# Altium project dory-x.PrjPcb (part 2 of 12)
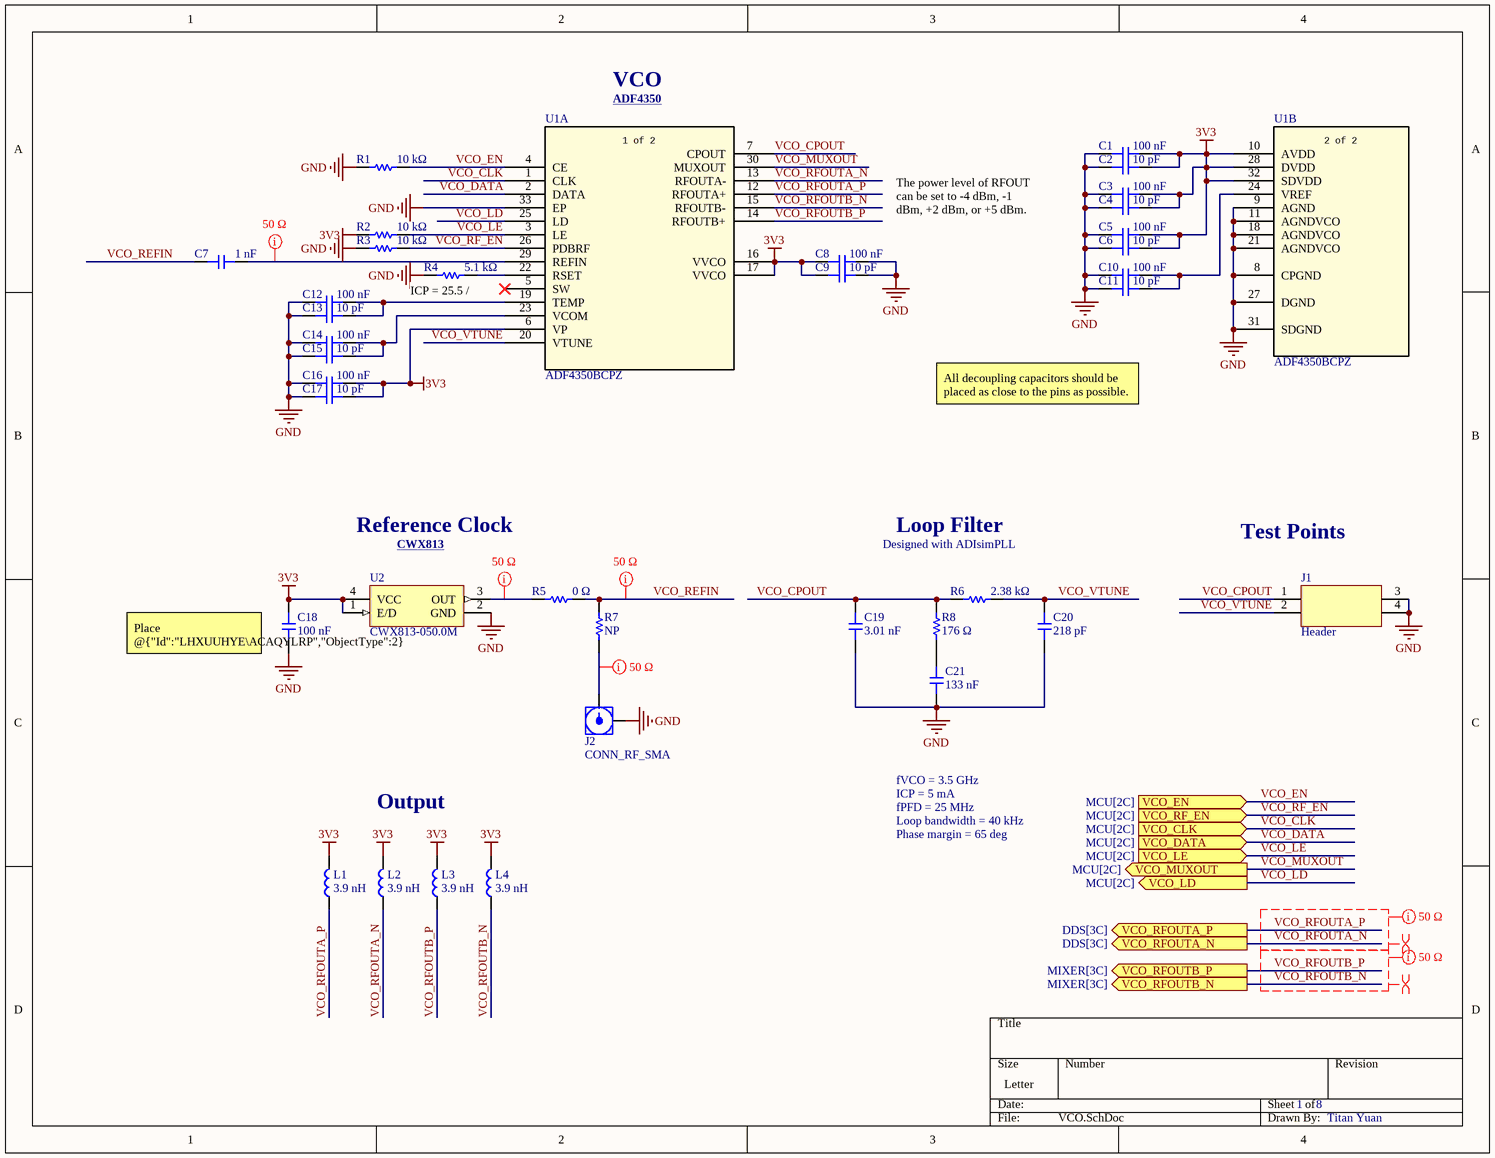
[diagram p8: VCO.SchDoc]

## Sheet VCO.SchDoc (continued)
### Library data of the parts
C1 C3 C5 C8 C10 C12 C14 C16 C18 = CAP: Ceramic Capacitor, Ceramic, 50V, 10% +Tol, 10% -Tol, X7R, 15% TC, 0.1uF, Surface Mount, 0402; Manufacturer: Yageo; Manufacturer Part Number: CC0402KPX7R9BB104; Tolerance: +-10%; Value: 100nF; Voltage Rating: 50 V; Dielectric: Ceramic; Package Size: 0402; Supplier: DigiKey; Supplier Part Number: 13-CC0402KPX7R9BB104CT-ND; RoHS: Compliant; Category: Ceramic Capacitors; Stock: 40680; Pricing: 1=0.1, 10=0.053, 50=0.0364, 100=0.0313, 500=0.02292, 1000=0.02035, 2500=0.01764, 5000=0.01601 (USD); Case/Package: 0402; China RoHS: Compliant; Dielectric Material: Ceramic; Height: 500µm; Lead Free: Lead Free; Length: 1mm; Lifecycle Status: Production; Max Operating Temperature: 125°C; Min Operating Temperature: -55°C; Mounting Technology: Surface Mount; Number of Terminals: 2; REACH SVHC: Yes; Voltage Rating (DC): 50V; Width: 500µm; ComponentLink1URL: https://datasheet.octopart.com:443/CC0402KPX7R9BB104-Yageo-datasheet-177165144.pdf?src-supplier=IHS; ComponentLink1Description: https://datasheet.octopart.com:443/CC0402KPX7R9BB104-Yageo-datasheet-177165144.pdf?src-supplier=IHS; ComponentLink2URL: https://datasheet.octopart.com:443/CC0402KPX7R9BB104-Yageo-Group-datasheet-189192896.pdf?src-supplier=Future+Electronics; ComponentLink2Description: https://datasheet.octopart.com:443/CC0402KPX7R9BB104-Yageo-Group-datasheet-189192896.pdf?src-supplier=Future+Electronics; ComponentLink3URL: https://datasheet.octopart.com:443/CC0402KPX7R9BB104-Yageo-datasheet-181967134.pdf?src-supplier=Farnell; ComponentLink3Description: https://datasheet.octopart.com:443/CC0402KPX7R9BB104-Yageo-datasheet-181967134.pdf?src-supplier=Farnell; ComponentLink4URL: https://datasheet.octopart.com/Surface-Mount-Ceramic-Multilayer-Capacitors%3B-General-Purpose-%26-High-Capacitance-Class-2%2C-X7R-Yageo-datasheet-family-114.pdf; ComponentLink4Description: https://datasheet.octopart.com/Surface-Mount-Ceramic-Multilayer-Capacitors%3B-General-Purpose-%26-High-Capacitance-Class-2%2C-X7R-Yageo-datasheet-family-114.pdf; ComponentLink5URL: https://datasheet.octopart.com/CC0402KPX7R9BB104-Yageo-datasheet-10883670.pdf; ComponentLink5Description: https://datasheet.octopart.com/CC0402KPX7R9BB104-Yageo-datasheet-10883670.pdf; ComponentLink6URL: http://sigma.octopart.com:80/rohs_statement/Surface-Mount-Ceramic-Multilayer-Capacitors%3B-General-Purpose-%26-High-Capacitance-Class-2%2C-X7R-Yageo-family-124.pdf?src-supplier=Compliance+Statements; ComponentLink6Description: http://sigma.octopart.com:80/rohs_statement/Surface-Mount-Ceramic-Multilayer-Capacitors%3B-General-Purpose-%26-High-Capacitance-Class-2%2C-X7R-Yageo-family-124.pdf?src-supplier=Compliance+Statements; ComponentLink7URL: http://sigma.octopart.com:80/reach_statement/Surface-Mount-Ceramic-Multilayer-Capacitors%3B-General-Purpose-%26-High-Capacitance-Class-2%2C-X7R-Yageo-family-125.pdf?src-supplier=Compliance+Statements; ComponentLink7Description: http://sigma.octopart.com:80/reach_statement/Surface-Mount-Ceramic-Multilayer-Capacitors%3B-General-Purpose-%26-High-Capacitance-Class-2%2C-X7R-Yageo-family-125.pdf?src-supplier=Compliance+Statements; ComponentLink8URL: http://sigma.octopart.com:80/conflict_mineral_statement/Yageo-company-3.pdf?src-supplier=Compliance+Statements; ComponentLink8Description: http://sigma.octopart.com:80/conflict_mineral_statement/Yageo-company-3.pdf?src-supplier=Compliance+Statements; ComponentLink9URL: http://sigma.octopart.com:80/rohs_statement/Yageo-company-2.pdf?src-supplier=Compliance+Statements; ComponentLink9Description: http://sigma.octopart.com:80/rohs_statement/Yageo-company-2.pdf?src-supplier=Compliance+Statements
C2 C4 C6 C9 C11 C13 C15 C17 = CAP: 50V 10pF C0G ±1% 0402 Multilayer Ceramic Capacitors MLCC - SMD/SMT ROHS; Manufacturer: Murata Electronics; Manufacturer Part Number: GRM1555C1H100FA01D; Manufacturer Lifecycle Status: NRND; Tolerance: +-1%; Voltage Rating: 50 V; Dielectric: Ceramic; Package Size: 0402; Supplier: DigiKey; Supplier Part Number: 490-6186-1-ND; RoHS: Compliant; Category: Ceramic Capacitors; Stock: 3575844; Pricing: 1=0.1, 10=0.042, 50=0.0286, 100=0.0246, 500=0.0178, 1000=0.01571, 2500=0.01351, 5000=0.01219 (USD); Value: 10pF; Case/Package: 0402; Case Code (Imperial): 0402; Case Code (Metric): 1005; Depth: 500µm; Dielectric Material: Ceramic; Export Control Classification Number (ECCN) Code: EAR99; Height: 500µm; Harmonized Tariff Schedule (HTS) Code: 8532.24.00.20; Introduction Date: 2012-06-13; Lead Free: Lead Free; Length: 1mm; Lifecycle Status: NRND; Max Operating Temperature: 125°C; Min Operating Temperature: -55°C; Mounting Technology: Surface Mount; Number of Terminals: 2; Packaging: Cut Tape; Radiation Hardening: No; REACH SVHC: Yes; Schedule B: 8532240020, 8532240020|8532240020, 8532240020|8532240020|8532240020, 8532240020|8532240020|8532240020|8532240020; Termination: SMD/SMT; Thickness: 500µm; Voltage Rating (DC): 50V; Width: 500µm; ComponentLink1URL: https://datasheet.octopart.com:443/GRM1555C1H100FA01D-Murata-datasheet-66077043.pdf?src-supplier=element14+APAC; ComponentLink1Description: https://datasheet.octopart.com:443/GRM1555C1H100FA01D-Murata-datasheet-66077043.pdf?src-supplier=element14+APAC; ComponentLink2URL: https://datasheet.octopart.com:443/GRM1555C1H100FA01D-Murata-datasheet-141266224.pdf?src-supplier=Ciiva; ComponentLink2Description: https://datasheet.octopart.com:443/GRM1555C1H100FA01D-Murata-datasheet-141266224.pdf?src-supplier=Ciiva; ComponentLink3URL: https://datasheet.octopart.com:443/GRM1555C1H100FA01D-Murata-datasheet-140680630.pdf?src-supplier=Ciiva; ComponentLink3Description: https://datasheet.octopart.com:443/GRM1555C1H100FA01D-Murata-datasheet-140680630.pdf?src-supplier=Ciiva; ComponentLink4URL: https://datasheet.octopart.com:443/GRM1555C1H100FA01D-Murata-datasheet-138739437.pdf?src-supplier=Ciiva; ComponentLink4Description: https://datasheet.octopart.com:443/GRM1555C1H100FA01D-Murata-datasheet-138739437.pdf?src-supplier=Ciiva; ComponentLink5URL: https://datasheet.octopart.com:443/GRM1555C1H100FA01D-Murata-datasheet-120101189.pdf?src-supplier=Megastar; ComponentLink5Description: https://datasheet.octopart.com:443/GRM1555C1H100FA01D-Murata-datasheet-120101189.pdf?src-supplier=Megastar; ComponentLink6URL: https://datasheet.octopart.com:443/GRM1555C1H100FA01D-Murata-datasheet-22122223.pdf?src-supplier=Future+Electronics; ComponentLink6Description: https://datasheet.octopart.com:443/GRM1555C1H100FA01D-Murata-datasheet-22122223.pdf?src-supplier=Future+Electronics; ComponentLink7URL: https://datasheet.octopart.com:443/GRM1555C1H100FA01D-Murata-datasheet-12510170.pdf?src-supplier=Future+Electronics; ComponentLink7Description: https://datasheet.octopart.com:443/GRM1555C1H100FA01D-Murata-datasheet-12510170.pdf?src-supplier=Future+Electronics; ComponentLink8URL: https://datasheet.octopart.com:443/GRM1555C1H100FA01D-Murata-datasheet-8517407.pdf?src-supplier=Future+Electronics; ComponentLink8Description: https://datasheet.octopart.com:443/GRM1555C1H100FA01D-Murata-datasheet-8517407.pdf?src-supplier=Future+Electronics; ComponentLink9URL: https://datasheet.octopart.com:443/GRM1555C1H100FA01D-Murata-datasheet-8387045.pdf?src-supplier=Future+Electronics; ComponentLink9Description: https://datasheet.octopart.com:443/GRM1555C1H100FA01D-Murata-datasheet-8387045.pdf?src-supplier=Future+Electronics; ComponentLink10URL: https://datasheet.octopart.com:443/GRM1555C1H100FA01D-Murata-datasheet-8324201.pdf?src-supplier=Future+Electronics; ComponentLink10Description: https://datasheet.octopart.com:443/GRM1555C1H100FA01D-Murata-datasheet-8324201.pdf?src-supplier=Future+Electronics; ComponentLink11URL: https://datasheet.octopart.com:443/GRM1555C1H100FA01D-Murata-datasheet-7628724.pdf?src-supplier=Future+Electronics; ComponentLink11Description: https://datasheet.octopart.com:443/GRM1555C1H100FA01D-Murata-datasheet-7628724.pdf?src-supplier=Future+Electronics; ComponentLink12URL: https://datasheet.octopart.com:443/GRM1555C1H100FA01D-Murata-datasheet-552801.pdf?src-supplier=Future+Electronics; ComponentLink12Description: https://datasheet.octopart.com:443/GRM1555C1H100FA01D-Murata-datasheet-552801.pdf?src-supplier=Future+Electronics; ComponentLink13URL: https://datasheet.octopart.com/GRM1555C1H100FA01D-Murata-datasheet-12515295.pdf; ComponentLink13Description: https://datasheet.octopart.com/GRM1555C1H100FA01D-Murata-datasheet-12515295.pdf; ComponentLink14URL: https://datasheet.octopart.com/GRM1555C1H100FA01D-Murata-datasheet-12510076.pdf; ComponentLink14Description: https://datasheet.octopart.com/GRM1555C1H100FA01D-Murata-datasheet-12510076.pdf; ComponentLink15URL: https://datasheet.octopart.com/GRM1555C1H100FA01D-Murata-datasheet-11978611.pdf; ComponentLink15Description: https://datasheet.octopart.com/GRM1555C1H100FA01D-Murata-datasheet-11978611.pdf; ComponentLink16URL: https://datasheet.octopart.com/GRM1555C1H100FA01D-Murata-datasheet-10025737.pdf; ComponentLink16Description: https://datasheet.octopart.com/GRM1555C1H100FA01D-Murata-datasheet-10025737.pdf; ComponentLink17URL: https://datasheet.octopart.com/GRM1555C1H100FA01D-Murata-datasheet-8819587.pdf; ComponentLink17Description: https://datasheet.octopart.com/GRM1555C1H100FA01D-Murata-datasheet-8819587.pdf; ComponentLink18URL: https://datasheet.octopart.com:443/GRM1555C1H100FA01D-Murata-datasheet-11729174.pdf?src-supplier=Arrow+Electronics; ComponentLink18Description: https://datasheet.octopart.com:443/GRM1555C1H100FA01D-Murata-datasheet-11729174.pdf?src-supplier=Arrow+Electronics; ComponentLink19URL: http://sigma.octopart.com:80/reach_statement/Murata-company-16.pdf?src-supplier=Compliance+Statements; ComponentLink19Description: http://sigma.octopart.com:80/reach_statement/Murata-company-16.pdf?src-supplier=Compliance+Statements
C7 = CAP: 50V 1nF X7R ±10% 0402 Multilayer Ceramic Capacitors MLCC - SMD/SMT ROHS; Manufacturer: Yageo; Manufacturer Part Number: CC0402KRX7R9BB102; Tolerance: +-10%; Insulation Resistance: 100GΩ; Temperature Coefficient: 30ppm/°C; Voltage Rating: 50 V; Dielectric: Ceramic; Package Size: 0402; Supplier: DigiKey; Supplier Part Number: 311-1036-1-ND; RoHS: Compliant; Category: Ceramic Capacitors; Stock: 3090255; Pricing: 1=0.08, 10=0.004 (USD); Value: 1nF; Case/Package: 0402; Case Code (Imperial): 0402; Case Code (Metric): 1005; China RoHS: Compliant; Composition: Ceramic; Country of Origin: Mainland China, Taiwan; Depth: 500µm; Dielectric Material: Ceramic; Export Control Classification Number (ECCN) Code: EAR99; Halogen Free: Halogen Free; Height: 500µm; Harmonized Tariff Schedule (HTS) Code: 8532.24.00.20; Introduction Date: 2003-01-27; Lead Free: Lead Free; Length: 1mm; Lifecycle Status: Production; Material: Ceramic; Max Operating Temperature: 125°C; Min Operating Temperature: -55°C; Mounting Technology: Surface Mount; Pins: 2; Number of Terminals: 2; Radiation Hardening: No; REACH SVHC: Yes; Schedule B: 8532240020, 8532240020|8532240020|8532240020|8532240020|8532240020|8532240020|8532240020|8532240020|8532240020|8532240020|8532240020|8532240020|8532240020|8532240020|8532240020|8532240020|8532240020|8532240020|8532240020|8532240020|8532240020|8532240020|8532240020|85; Termination: SMD/SMT; Thickness: 558.8µm; Voltage: 50V; Voltage Rating (AC): 50V; Voltage Rating (DC): 50V; Width: 500µm; ComponentLink1URL: https://datasheet.octopart.com:443/CC0402KRX7R9BB102-Yageo-datasheet-177165144.pdf?src-supplier=IHS; ComponentLink1Description: https://datasheet.octopart.com:443/CC0402KRX7R9BB102-Yageo-datasheet-177165144.pdf?src-supplier=IHS; ComponentLink2URL: https://datasheet.octopart.com:443/CC0402KRX7R9BB102-Yageo-datasheet-82288757.pdf?src-supplier=Upverter; ComponentLink2Description: https://datasheet.octopart.com:443/CC0402KRX7R9BB102-Yageo-datasheet-82288757.pdf?src-supplier=Upverter; ComponentLink3URL: https://datasheet.octopart.com:443/CC0402KRX7R9BB102-Yageo-datasheet-78855684.pdf?src-supplier=Upverter; ComponentLink3Description: https://datasheet.octopart.com:443/CC0402KRX7R9BB102-Yageo-datasheet-78855684.pdf?src-supplier=Upverter; ComponentLink4URL: https://datasheet.octopart.com/CC0402KRX7R9BB102-Yageo-datasheet-10883670.pdf; ComponentLink4Description: https://datasheet.octopart.com/CC0402KRX7R9BB102-Yageo-datasheet-10883670.pdf; ComponentLink5URL: https://datasheet.octopart.com:443/CC0402KRX7R9BB102-Yageo-datasheet-147453679.pdf?src-supplier=Farnell; ComponentLink5Description: https://datasheet.octopart.com:443/CC0402KRX7R9BB102-Yageo-datasheet-147453679.pdf?src-supplier=Farnell; ComponentLink6URL: https://datasheet.octopart.com:443/CC0402KRX7R9BB102-Yageo-datasheet-151948686.pdf?src-supplier=Farnell; ComponentLink6Description: https://datasheet.octopart.com:443/CC0402KRX7R9BB102-Yageo-datasheet-151948686.pdf?src-supplier=Farnell; ComponentLink7URL: https://datasheet.octopart.com:443/CC0402KRX7R9BB102-Phycomp-datasheet-500777.pdf?src-supplier=Farnell; ComponentLink7Description: https://datasheet.octopart.com:443/CC0402KRX7R9BB102-Phycomp-datasheet-500777.pdf?src-supplier=Farnell; ComponentLink8URL: https://datasheet.octopart.com:443/CC0402KRX7R9BB102-Yageo-datasheet-5301394.pdf?src-supplier=Newark; ComponentLink8Description: https://datasheet.octopart.com:443/CC0402KRX7R9BB102-Yageo-datasheet-5301394.pdf?src-supplier=Newark; ComponentLink9URL: https://datasheet.octopart.com:443/CC0402KRX7R9BB102-Yageo-datasheet-62336348.pdf?src-supplier=Newark; ComponentLink9Description: https://datasheet.octopart.com:443/CC0402KRX7R9BB102-Yageo-datasheet-62336348.pdf?src-supplier=Newark; ComponentLink10URL: https://datasheet.octopart.com:443/CC0402KRX7R9BB102-Yageo-datasheet-182878162.pdf?src-supplier=Newark; ComponentLink10Description: https://datasheet.octopart.com:443/CC0402KRX7R9BB102-Yageo-datasheet-182878162.pdf?src-supplier=Newark; ComponentLink11URL: https://datasheet.octopart.com:443/CC0402KRX7R9BB102-Phycomp-datasheet-499490.pdf?src-supplier=element14; ComponentLink11Description: https://datasheet.octopart.com:443/CC0402KRX7R9BB102-Phycomp-datasheet-499490.pdf?src-supplier=element14; ComponentLink12URL: https://datasheet.octopart.com:443/CC0402KRX7R9BB102-Yageo-datasheet-8701427.pdf?src-supplier=element14; ComponentLink12Description: https://datasheet.octopart.com:443/CC0402KRX7R9BB102-Yageo-datasheet-8701427.pdf?src-supplier=element14; ComponentLink13URL: https://datasheet.octopart.com:443/CC0402KRX7R9BB102-Yageo-datasheet-166511530.pdf?src-supplier=Future+Electronics; ComponentLink13Description: https://datasheet.octopart.com:443/CC0402KRX7R9BB102-Yageo-datasheet-166511530.pdf?src-supplier=Future+Electronics; ComponentLink14URL: https://datasheet.octopart.com:443/CC0402KRX7R9BB102-Yageo-datasheet-137700082.pdf?src-supplier=Future+Electronics; ComponentLink14Description: https://datasheet.octopart.com:443/CC0402KRX7R9BB102-Yageo-datasheet-137700082.pdf?src-supplier=Future+Electronics; ComponentLink15URL: https://datasheet.octopart.com:443/CC0402KRX7R9BB102-Yageo-datasheet-137700084.pdf?src-supplier=Future+Electronics; ComponentLink15Description: https://datasheet.octopart.com:443/CC0402KRX7R9BB102-Yageo-datasheet-137700084.pdf?src-supplier=Future+Electronics; ComponentLink16URL: https://datasheet.octopart.com:443/CC0402KRX7R9BB102-Yageo-datasheet-78855685.pdf?src-supplier=Future+Electronics; ComponentLink16Description: https://datasheet.octopart.com:443/CC0402KRX7R9BB102-Yageo-datasheet-78855685.pdf?src-supplier=Future+Electronics; ComponentLink17URL: https://datasheet.octopart.com:443/CC0402KRX7R9BB102-Yageo-datasheet-27626582.pdf?src-supplier=Future+Electronics; ComponentLink17Description: https://datasheet.octopart.com:443/CC0402KRX7R9BB102-Yageo-datasheet-27626582.pdf?src-supplier=Future+Electronics; ComponentLink18URL: https://datasheet.octopart.com:443/CC0402KRX7R9BB102-Yageo-datasheet-24578986.pdf?src-supplier=Future+Electronics; ComponentLink18Description: https://datasheet.octopart.com:443/CC0402KRX7R9BB102-Yageo-datasheet-24578986.pdf?src-supplier=Future+Electronics; ComponentLink19URL: https://datasheet.octopart.com:443/CC0402KRX7R9BB102-Yageo-datasheet-15895757.pdf?src-supplier=Future+Electronics; ComponentLink19Description: https://datasheet.octopart.com:443/CC0402KRX7R9BB102-Yageo-datasheet-15895757.pdf?src-supplier=Future+Electronics; ComponentLink20URL: https://datasheet.octopart.com:443/CC0402KRX7R9BB102-Yageo-datasheet-12526321.pdf?src-supplier=Future+Electronics; ComponentLink20Description: https://datasheet.octopart.com:443/CC0402KRX7R9BB102-Yageo-datasheet-12526321.pdf?src-supplier=Future+Electronics; ComponentLink21URL: https://datasheet.octopart.com:443/CC0402KRX7R9BB102-Yageo-datasheet-8324192.pdf?src-supplier=Future+Electronics; ComponentLink21Description: https://datasheet.octopart.com:443/CC0402KRX7R9BB102-Yageo-datasheet-8324192.pdf?src-supplier=Future+Electronics; ComponentLink22URL: https://datasheet.octopart.com:443/CC0402KRX7R9BB102-Yageo-datasheet-68298032.pdf?src-supplier=Future+Electronics; ComponentLink22Description: https://datasheet.octopart.com:443/CC0402KRX7R9BB102-Yageo-datasheet-68298032.pdf?src-supplier=Future+Electronics; ComponentLink23URL: https://datasheet.octopart.com:443/CC0402KRX7R9BB102-Yageo-datasheet-178018854.pdf?src-supplier=Burklin+Elektronik; ComponentLink23Description: https://datasheet.octopart.com:443/CC0402KRX7R9BB102-Yageo-datasheet-178018854.pdf?src-supplier=Burklin+Elektronik; ComponentLink24URL: https://datasheet.octopart.com:443/CC0402KRX7R9BB102-Yageo-Group-datasheet-165992755.pdf?src-supplier=ODG+(Origin+Data+Global); ComponentLink24Description: https://datasheet.octopart.com:443/CC0402KRX7R9BB102-Yageo-Group-datasheet-165992755.pdf?src-supplier=ODG+(Origin+Data+Global); ComponentLink25URL: https://datasheet.octopart.com:443/CC0402KRX7R9BB102-Yageo-datasheet-120101875.pdf?src-supplier=Megastar; ComponentLink25Description: https://datasheet.octopart.com:443/CC0402KRX7R9BB102-Yageo-datasheet-120101875.pdf?src-supplier=Megastar; ComponentLink26URL: https://datasheet.octopart.com:443/CC0402KRX7R9BB102-Yageo-datasheet-118396.pdf?src-supplier=DigiKey; ComponentLink26Description: https://datasheet.octopart.com:443/CC0402KRX7R9BB102-Yageo-datasheet-118396.pdf?src-supplier=DigiKey; ComponentLink27URL: http://sigma.octopart.com:80/conflict_mineral_statement/Yageo-company-3.pdf?src-supplier=Compliance+Statements; ComponentLink27Description: http://sigma.octopart.com:80/conflict_mineral_statement/Yageo-company-3.pdf?src-supplier=Compliance+Statements; ComponentLink28URL: http://sigma.octopart.com:80/rohs_statement/Yageo-company-2.pdf?src-supplier=Compliance+Statements; ComponentLink28Description: http://sigma.octopart.com:80/rohs_statement/Yageo-company-2.pdf?src-supplier=Compliance+Statements
C19 = CAP: Ceramic Capacitor, YES, Ceramic, 50V, 1% +Tol, 1% -Tol, C0G, 30ppm/Cel TC, 0.003uF, Surface Mount, 1608M/0603; Manufacturer: Murata Electronics; Manufacturer Part Number: GCM1885C1H302FA16J; Manufacturer Lifecycle Status: IN PRODUCTION; Tolerance: +-1%; Value: 3nF; Temperature Coefficient: 30ppm/°C; Voltage Rating: 50 V; Dielectric: Ceramic; Package Size: 0603; Supplier: DigiKey; Supplier Part Number: 490-GCM1885C1H302FA16JCT-ND; RoHS: Compliant; Category: Ceramic Capacitors; Stock: 41494; Pricing: 1=0.18, 10=0.102, 50=0.072, 100=0.063, 500=0.04632, 1000=0.04311, 2500=0.03819, 5000=0.03522 (USD); Case/Package: 0603; Dielectric Material: Ceramic; Height: 800µm; Length: 1.6mm; Lifecycle Status: Production; Material: Ceramic; Max Operating Temperature: 125°C; Min Operating Temperature: -55°C; Mounting Technology: Surface Mount; Number of Terminals: 2; REACH SVHC: Yes; Thickness: 800µm; Voltage Rating (DC): 50V; Width: 800µm; ComponentLink1URL: https://datasheet.octopart.com:443/GCM1885C1H302FA16J-Murata-datasheet-141266224.pdf?src-supplier=Ciiva; ComponentLink1Description: https://datasheet.octopart.com:443/GCM1885C1H302FA16J-Murata-datasheet-141266224.pdf?src-supplier=Ciiva; ComponentLink2URL: https://datasheet.octopart.com:443/GCM1885C1H302FA16J-Murata-datasheet-140656993.pdf?src-supplier=Ciiva; ComponentLink2Description: https://datasheet.octopart.com:443/GCM1885C1H302FA16J-Murata-datasheet-140656993.pdf?src-supplier=Ciiva; ComponentLink3URL: https://datasheet.octopart.com:443/GCM1885C1H302FA16J-Murata-datasheet-138716693.pdf?src-supplier=Ciiva; ComponentLink3Description: https://datasheet.octopart.com:443/GCM1885C1H302FA16J-Murata-datasheet-138716693.pdf?src-supplier=Ciiva; ComponentLink4URL: http://sigma.octopart.com:80/reach_statement/Murata-company-16.pdf?src-supplier=Compliance+Statements; ComponentLink4Description: http://sigma.octopart.com:80/reach_statement/Murata-company-16.pdf?src-supplier=Compliance+Statements
C20 = CAP: 100V 220pF C0G ±1% 0603 Multilayer Ceramic Capacitors MLCC - SMD/SMT ROHS; Manufacturer: Murata Electronics; Manufacturer Part Number: GCM1885C2A221FA16D; Manufacturer Lifecycle Status: IN PRODUCTION; Tolerance: +-1%; Temperature Coefficient: 30ppm/°C; Voltage Rating: 100 V; Dielectric: Ceramic; Package Size: 0603; Supplier: DigiKey; Supplier Part Number: 490-16412-1-ND; RoHS: Compliant; Category: Ceramic Capacitors; Stock: 398637; Pricing: 1=0.16, 10=0.091, 50=0.0644, 100=0.0562, 500=0.0424, 1000=0.03815 (USD); Value: 220pF; Case/Package: 0603; Dielectric Material: Ceramic; Export Control Classification Number (ECCN) Code: EAR99; Height: 800µm; Harmonized Tariff Schedule (HTS) Code: 8532.24.00.20; Introduction Date: 2013-11-20; Length: 1.6mm; Lifecycle Status: Production; Material: Ceramic; Max Operating Temperature: 125°C; Min Operating Temperature: -55°C; Mounting Technology: Surface Mount; Number of Terminals: 2; REACH SVHC: Yes; Schedule B: 8532240020, 8532240020|8532240020|8532240020|8532240020|8532240020; Thickness: 800µm; Voltage Rating (DC): 100V; Width: 800µm; ComponentLink1URL: https://datasheet.octopart.com:443/GCM1885C2A221FA16D-Murata-datasheet-149522634.pdf?src-supplier=Newark; ComponentLink1Description: https://datasheet.octopart.com:443/GCM1885C2A221FA16D-Murata-datasheet-149522634.pdf?src-supplier=Newark; ComponentLink2URL: https://datasheet.octopart.com:443/GCM1885C2A221FA16D-Murata-datasheet-141266627.pdf?src-supplier=Geoflip; ComponentLink2Description: https://datasheet.octopart.com:443/GCM1885C2A221FA16D-Murata-datasheet-141266627.pdf?src-supplier=Geoflip; ComponentLink3URL: https://datasheet.octopart.com:443/GCM1885C2A221FA16D-Murata-datasheet-140657483.pdf?src-supplier=Ciiva; ComponentLink3Description: https://datasheet.octopart.com:443/GCM1885C2A221FA16D-Murata-datasheet-140657483.pdf?src-supplier=Ciiva; ComponentLink4URL: https://datasheet.octopart.com:443/GCM1885C2A221FA16D-Murata-datasheet-138717127.pdf?src-supplier=Ciiva; ComponentLink4Description: https://datasheet.octopart.com:443/GCM1885C2A221FA16D-Murata-datasheet-138717127.pdf?src-supplier=Ciiva; ComponentLink5URL: https://datasheet.octopart.com:443/GCM1885C2A221FA16D-Murata-datasheet-12511495.pdf?src-supplier=TME; ComponentLink5Description: https://datasheet.octopart.com:443/GCM1885C2A221FA16D-Murata-datasheet-12511495.pdf?src-supplier=TME; ComponentLink6URL: http://sigma.octopart.com:80/reach_statement/Murata-company-16.pdf?src-supplier=Compliance+Statements; ComponentLink6Description: http://sigma.octopart.com:80/reach_statement/Murata-company-16.pdf?src-supplier=Compliance+Statements
C21 = CAP: Ceramic Capacitor, Ceramic, 50V, 5% +Tol, 5% -Tol, X7R, 15% TC, 0.15uF, Surface Mount, 0603; Manufacturer: Yageo; Manufacturer Part Number: CC0603JRX7R9BB154; Tolerance: +-5%; Value: 150nF; Voltage Rating: 50 V; Dielectric: Ceramic; Package Size: 0603; Supplier: DigiKey; Supplier Part Number: 13-CC0603JRX7R9BB154CT-ND; RoHS: Compliant; Category: Ceramic Capacitors; Stock: 14157; Pricing: 1=0.13, 10=0.075, 50=0.0526, 100=0.0457, 500=0.0341, 1000=0.03053 (USD); Case/Package: 0603; China RoHS: Compliant; Country of Origin: Mainland China, Taiwan; Dielectric Material: Ceramic; Export Control Classification Number (ECCN) Code: EAR99; Halogen Free: Halogen Free; Height: 800µm; Harmonized Tariff Schedule (HTS) Code: 8532.24.00.20; Introduction Date: 2014-07-08; Lead Free: Lead Free; Length: 1.6mm; Lifecycle Status: Production; Max Operating Temperature: 125°C; Min Operating Temperature: -55°C; Mounting Technology: Surface Mount; Number of Terminals: 2; REACH SVHC: Yes; Voltage Rating (DC): 50V; Width: 800µm; ComponentLink1URL: https://datasheet.octopart.com:443/CC0603JRX7R9BB154-Yageo-datasheet-177165144.pdf?src-supplier=IHS; ComponentLink1Description: https://datasheet.octopart.com:443/CC0603JRX7R9BB154-Yageo-datasheet-177165144.pdf?src-supplier=IHS; ComponentLink2URL: https://datasheet.octopart.com:443/CC0603JRX7R9BB154-Yageo-datasheet-181968371.pdf?src-supplier=Newark; ComponentLink2Description: https://datasheet.octopart.com:443/CC0603JRX7R9BB154-Yageo-datasheet-181968371.pdf?src-supplier=Newark; ComponentLink3URL: https://datasheet.octopart.com/CC0603JRX7R9BB154-Yageo-datasheet-10883670.pdf; ComponentLink3Description: https://datasheet.octopart.com/CC0603JRX7R9BB154-Yageo-datasheet-10883670.pdf; ComponentLink4URL: http://sigma.octopart.com:80/conflict_mineral_statement/Yageo-company-3.pdf?src-supplier=Compliance+Statements; ComponentLink4Description: http://sigma.octopart.com:80/conflict_mineral_statement/Yageo-company-3.pdf?src-supplier=Compliance+Statements; ComponentLink5URL: http://sigma.octopart.com:80/rohs_statement/Yageo-company-2.pdf?src-supplier=Compliance+Statements; ComponentLink5Description: http://sigma.octopart.com:80/rohs_statement/Yageo-company-2.pdf?src-supplier=Compliance+Statements
J1 = CONN_2x2_2.54mm_PinHeader_Vertical: Pin Header, Board-to-Board, 2.54 mm, 2 Rows, 4 Contacts, Through Hole, TSW Series; Manufacturer: Samtec; Manufacturer Part Number: TSW-102-07-F-D; Manufacturer Lifecycle Status: PRODUCTION; Connector Type: Male Pin; Gender: Male; Max Current Rating: 7.6A; Max Voltage Rating (AC): 550V; Number of Contacts: 4; Pitch: 2.54mm; Supplier: DigiKey; Supplier Part Number: SAM10843-ND; RoHS: Compliant; Category: Headers and Wire Housings; Stock: 11283; Pricing: 1=0.22, 50=0.19, 100=0.16, 500=0.14, 1000=0.11, 2000=0.1, 5000=0.09, 10000=0.08206 (USD); Color: Black; Contact Material: Bronze; Contact Mating Length: 5.842mm; Contact Plating: Gold; Depth: 5.08mm; Housing Color: Black; Housing Material: Polyester; Lead Pitch: 2.54mm; Length: 5.08mm; Lifecycle Status: Production; Max Operating Temperature: 125°C; Min Operating Temperature: -55°C; Mounting Technology: Through Hole; Number of Positions: 4; Number of Rows: 2; Orientation: Straight; Radiation Hardening: No; REACH SVHC: No; Row Spacing: 2.54mm; Termination: Solder; ComponentLink1URL: https://datasheet.octopart.com:443/TSW-102-07-F-D-Samtec-datasheet-97325576.pdf?src-supplier=Sager+Electronics; ComponentLink1Description: https://datasheet.octopart.com:443/TSW-102-07-F-D-Samtec-datasheet-97325576.pdf?src-supplier=Sager+Electronics; ComponentLink2URL: https://datasheet.octopart.com:443/TSW-102-07-F-D-Samtec-datasheet-151455181.pdf?src-supplier=Sager+Electronics; ComponentLink2Description: https://datasheet.octopart.com:443/TSW-102-07-F-D-Samtec-datasheet-151455181.pdf?src-supplier=Sager+Electronics; ComponentLink3URL: https://sigma.octopart.com:443/97325577/technical_drawing/Samtec-TSW-102-07-F-D.pdf?src-supplier=HQonline; ComponentLink3Description: https://sigma.octopart.com:443/97325577/technical_drawing/Samtec-TSW-102-07-F-D.pdf?src-supplier=HQonline; ComponentLink4URL: https://datasheet.octopart.com:443/TSW-102-07-F-D-Samtec-datasheet-62107121.pdf?src-supplier=Farnell; ComponentLink4Description: https://datasheet.octopart.com:443/TSW-102-07-F-D-Samtec-datasheet-62107121.pdf?src-supplier=Farnell; ComponentLink5URL: https://datasheet.octopart.com:443/TSW-102-07-F-D-Samtec-datasheet-136646178.pdf?src-supplier=Master+Electronics; ComponentLink5Description: https://datasheet.octopart.com:443/TSW-102-07-F-D-Samtec-datasheet-136646178.pdf?src-supplier=Master+Electronics; ComponentLink6URL: https://datasheet.octopart.com:443/TSW-102-07-F-D-Samtec-datasheet-118235302.pdf?src-supplier=Electro+Sonic; ComponentLink6Description: https://datasheet.octopart.com:443/TSW-102-07-F-D-Samtec-datasheet-118235302.pdf?src-supplier=Electro+Sonic; ComponentLink7URL: https://datasheet.octopart.com:443/TSW-102-07-F-D-Samtec-datasheet-180258786.pdf?src-supplier=JRH+Electronics; ComponentLink7Description: https://datasheet.octopart.com:443/TSW-102-07-F-D-Samtec-datasheet-180258786.pdf?src-supplier=JRH+Electronics; ComponentLink8URL: https://datasheet.octopart.com:443/TSW-102-07-F-D-Samtec-datasheet-160657603.pdf?src-supplier=Toby+Electronics; ComponentLink8Description: https://datasheet.octopart.com:443/TSW-102-07-F-D-Samtec-datasheet-160657603.pdf?src-supplier=Toby+Electronics; ComponentLink9URL: https://datasheet.octopart.com:443/TSW-102-07-F-D-Samtec-datasheet-116539033.pdf?src-supplier=Toby+Electronics; ComponentLink9Description: https://datasheet.octopart.com:443/TSW-102-07-F-D-Samtec-datasheet-116539033.pdf?src-supplier=Toby+Electronics; ComponentLink10URL: https://datasheet.octopart.com:443/TSW-102-07-F-D-Samtec-datasheet-116536310.pdf?src-supplier=Toby+Electronics; ComponentLink10Description: https://datasheet.octopart.com:443/TSW-102-07-F-D-Samtec-datasheet-116536310.pdf?src-supplier=Toby+Electronics; ComponentLink11URL: https://datasheet.octopart.com/TSW-102-07-F-D-Samtec-datasheet-86818365.pdf; ComponentLink11Description: https://datasheet.octopart.com/TSW-102-07-F-D-Samtec-datasheet-86818365.pdf; ComponentLink12URL: https://datasheet.octopart.com:443/TSW-102-07-F-D-Samtec-datasheet-11047283.pdf?src-supplier=Newark; ComponentLink12Description: https://datasheet.octopart.com:443/TSW-102-07-F-D-Samtec-datasheet-11047283.pdf?src-supplier=Newark
J2 = CONN_RF_SMA: RF / Coaxial Connector, SMA Coaxial, Straight Jack, Solder, 50 ohm, Beryllium Copper; Manufacturer: Cinch Connectivity Solutions Johnson; Maximum Frequency: 18 GHz; Body Material: Brass; Body Plating: Gold; Connector Type: Coaxial, PCB, SMA, Socket; Contact Resistance: 4mΩ; Dielectric Material: PTFE; Frequency: 18GHz; Gender: Female; Impedance: 50Ω; Insulation Resistance: 5GΩ; Number of Contacts: 1; Polarity: Normal; Voltage Rating: 335V; Manufacturer Part Number: 142-0701-801; Supplier: DigiKey; Supplier Part Number: J502-ND; RoHS: Compliant; Category: RF / Coaxial Connectors; Stock: 35108; Pricing: 1=3.73, 10=3.166, 25=2.9676, 50=2.826, 100=2.691, 250=2.52244, 500=2.40206, 1000=2.28748, 2500=2.1444 (USD); Case/Package: SMA; Contact Gender: Female; Contact Material: Gold, Nickel; Contact Plating: Gold; Depth: 25.58mm; Export Control Classification Number (ECCN) Code: EAR99; Fastening Type: Threaded; Height: 9.779mm; Housing Color: Gold; Housing Material: Brass; Harmonized Tariff Schedule (HTS) Code: 8536.69.40.10; Insulation Material: PTFE; Introduction Date: 1994-06-01; Lead Free: Lead Free; Length: 9.52mm; Lifecycle Status: Production; Clock Frequency: 18GHz; Max Operating Temperature: 165°C; Min Operating Temperature: -65°C; Mounting Technology: Edge, PCB; Pins: 1; Number of Ports: 1; Orientation: Straight; Radiation Hardening: No; REACH SVHC: No; Schedule B: 8536695050, 8536695050|8536695050|8536695050|8536695050|8536695050; Shell Material: Brass; Termination: Solder; ComponentLink1URL: https://datasheet.octopart.com:443/142-0701-801-Cinch-Connectors-datasheet-38159423.pdf?src-supplier=element14+APAC; ComponentLink1Description: https://datasheet.octopart.com:443/142-0701-801-Cinch-Connectors-datasheet-38159423.pdf?src-supplier=element14+APAC; ComponentLink2URL: https://datasheet.octopart.com:443/142-0701-801-Cinch-Connectivity-Solutions-datasheet-128878268.pdf?src-supplier=JRH+Electronics; ComponentLink2Description: https://datasheet.octopart.com:443/142-0701-801-Cinch-Connectivity-Solutions-datasheet-128878268.pdf?src-supplier=JRH+Electronics; ComponentLink3URL: https://datasheet.octopart.com:443/142-0701-801-Cinch-Connectivity-Solutions-datasheet-180501451.pdf?src-supplier=IHS; ComponentLink3Description: https://datasheet.octopart.com:443/142-0701-801-Cinch-Connectivity-Solutions-datasheet-180501451.pdf?src-supplier=IHS; ComponentLink4URL: https://datasheet.octopart.com:443/142-0701-801-Cinch-Connectivity-Solutions-datasheet-182240672.pdf?src-supplier=IHS; ComponentLink4Description: https://datasheet.octopart.com:443/142-0701-801-Cinch-Connectivity-Solutions-datasheet-182240672.pdf?src-supplier=IHS; ComponentLink5URL: https://datasheet.octopart.com:443/142-0701-801-Emerson-datasheet-182246267.pdf?src-supplier=IHS; ComponentLink5Description: https://datasheet.octopart.com:443/142-0701-801-Emerson-datasheet-182246267.pdf?src-supplier=IHS; ComponentLink6URL: https://datasheet.octopart.com:443/142-0701-801-Emerson-Network-Power-datasheet-40124.pdf?src-supplier=Newark; ComponentLink6Description: https://datasheet.octopart.com:443/142-0701-801-Emerson-Network-Power-datasheet-40124.pdf?src-supplier=Newark; ComponentLink7URL: https://datasheet.octopart.com:443/142-0701-801-Cinch-Connectors-datasheet-24914353.pdf?src-supplier=Electro+Sonic; ComponentLink7Description: https://datasheet.octopart.com:443/142-0701-801-Cinch-Connectors-datasheet-24914353.pdf?src-supplier=Electro+Sonic; ComponentLink8URL: https://datasheet.octopart.com:443/142-0701-801-Emerson-Network-Power-datasheet-14433785.pdf?src-supplier=Farnell; ComponentLink8Description: https://datasheet.octopart.com:443/142-0701-801-Emerson-Network-Power-datasheet-14433785.pdf?src-supplier=Farnell; ComponentLink9URL: https://datasheet.octopart.com:443/142-0701-801-Emerson-Network-Power-datasheet-8828422.pdf?src-supplier=Farnell; ComponentLink9Description: https://datasheet.octopart.com:443/142-0701-801-Emerson-Network-Power-datasheet-8828422.pdf?src-supplier=Farnell; ComponentLink10URL: https://datasheet.octopart.com:443/142-0701-801-Emerson-Network-Power-datasheet-10031126.pdf?src-supplier=Farnell; ComponentLink10Description: https://datasheet.octopart.com:443/142-0701-801-Emerson-Network-Power-datasheet-10031126.pdf?src-supplier=Farnell; ComponentLink11URL: https://datasheet.octopart.com:443/142-0701-801-Emerson-Network-Power-datasheet-47159.pdf?src-supplier=Farnell; ComponentLink11Description: https://datasheet.octopart.com:443/142-0701-801-Emerson-Network-Power-datasheet-47159.pdf?src-supplier=Farnell; ComponentLink12URL: https://datasheet.octopart.com:443/142-0701-801-Emerson-Network-Power-datasheet-29036.pdf?src-supplier=Farnell; ComponentLink12Description: https://datasheet.octopart.com:443/142-0701-801-Emerson-Network-Power-datasheet-29036.pdf?src-supplier=Farnell; ComponentLink13URL: https://datasheet.octopart.com:443/142-0701-801-Semflex-datasheet-33021794.pdf?src-supplier=East+Coast+Microwave; ComponentLink13Description: https://datasheet.octopart.com:443/142-0701-801-Semflex-datasheet-33021794.pdf?src-supplier=East+Coast+Microwave; ComponentLink14URL: https://datasheet.octopart.com:443/142-0701-801-Emerson-datasheet-31818286.pdf?src-supplier=East+Coast+Microwave; ComponentLink14Description: https://datasheet.octopart.com:443/142-0701-801-Emerson-datasheet-31818286.pdf?src-supplier=East+Coast+Microwave; ComponentLink15URL: https://datasheet.octopart.com:443/142-0701-801-Cinch-Connectors-datasheet-27682.pdf?src-supplier=RS+(Formerly+Allied+Electronics); ComponentLink15Description: https://datasheet.octopart.com:443/142-0701-801-Cinch-Connectors-datasheet-27682.pdf?src-supplier=RS+(Formerly+Allied+Electronics); ComponentLink16URL: https://datasheet.octopart.com:443/142-0701-801-Emerson-Network-Power-datasheet-644257.pdf?src-supplier=Future+Electronics; ComponentLink16Description: https://datasheet.octopart.com:443/142-0701-801-Emerson-Network-Power-datasheet-644257.pdf?src-supplier=Future+Electronics; ComponentLink17URL: https://datasheet.octopart.com:443/142-0701-801-Emerson-Network-Power-datasheet-55164.pdf?src-supplier=_legacy+Avnet; ComponentLink17Description: https://datasheet.octopart.com:443/142-0701-801-Emerson-Network-Power-datasheet-55164.pdf?src-supplier=_legacy+Avnet
L1-L4 = IND: Inductor RF Chip Wirewound 3.9nH 0.1nH 100MHz 25Q-Factor 750mA 70mOhm DCR 0402 Paper T/R; Manufacturer: Murata Electronics; Manufacturer Part Number: LQW15AN3N9B00D; Manufacturer Lifecycle Status: IN PRODUCTION; Tolerance: +-0.1 nH; Core Material: Non-Magnetic; DC Resistance (DCR): 70mΩ; Number of Circuits: 1; Q Factor: 25; Self Resonant Frequency: 10GHz; Shielding: Unshielded; Test Frequency: 250MHz; Current Rating: 750 mA; Package Size: 0402; Supplier: DigiKey; Supplier Part Number: 490-6812-1-ND; RoHS: Compliant; Category: Fixed Inductors; Stock: 15529; Pricing: 1=0.11, 10=0.094, 100=0.0774, 1000=0.06363, 5000=0.0555, 10000=0.05233, 20000=0.04935, 30000=0.04768, 50000=0.04566, 70000=0.04439, 100000=0.04307 (USD); Case/Package: 0402; Case Code (Imperial): 0402; Case Code (Metric): 1005; Composition: Wirewound; Country of Origin: Japan; Current: 750mA; DC Current: 750mA; Depth: 700µm; Export Control Classification Number (ECCN) Code: EAR99; Height: 500µm; Harmonized Tariff Schedule (HTS) Code: 8504.50.80.00; Value: 3.9nH; Introduction Date: 2004-08-09; Lead Free: Lead Free; Length: 1mm; Lifecycle Status: Production; Max Current Rating: 750mA; Max DC Current: 750mA; Max Operating Temperature: 125°C; Military Standard: Not; Min Operating Temperature: -55°C; Mounting Technology: Surface Mount; Pins: 2; Number of Terminals: 2; Packaging: Cut Tape; Radiation Hardening: No; REACH SVHC: Yes; RMS Current (Irms): 750mA; Schedule B: 8504500000, 8504500000|8504500000|8504500000|8504500000|8504500000; ESR: 70mΩ; Termination: SMD/SMT; Weight: 793.786648µg; Width: 600µm; ComponentLink1URL: https://datasheet.octopart.com:443/LQW15AN3N9B00D-Murata-datasheet-12510052.pdf?src-supplier=Newark; ComponentLink1Description: https://datasheet.octopart.com:443/LQW15AN3N9B00D-Murata-datasheet-12510052.pdf?src-supplier=Newark; ComponentLink2URL: https://datasheet.octopart.com:443/LQW15AN3N9B00D-Murata-datasheet-528315.pdf?src-supplier=Farnell; ComponentLink2Description: https://datasheet.octopart.com:443/LQW15AN3N9B00D-Murata-datasheet-528315.pdf?src-supplier=Farnell; ComponentLink3URL: https://datasheet.octopart.com:443/LQW15AN3N9B00D-Murata-datasheet-142541519.pdf?src-supplier=Ciiva; ComponentLink3Description: https://datasheet.octopart.com:443/LQW15AN3N9B00D-Murata-datasheet-142541519.pdf?src-supplier=Ciiva; ComponentLink4URL: https://datasheet.octopart.com:443/LQW15AN3N9B00D-Murata-datasheet-141294498.pdf?src-supplier=Ciiva; ComponentLink4Description: https://datasheet.octopart.com:443/LQW15AN3N9B00D-Murata-datasheet-141294498.pdf?src-supplier=Ciiva; ComponentLink5URL: https://datasheet.octopart.com:443/LQW15AN3N9B00D-Murata-datasheet-140716727.pdf?src-supplier=Ciiva; ComponentLink5Description: https://datasheet.octopart.com:443/LQW15AN3N9B00D-Murata-datasheet-140716727.pdf?src-supplier=Ciiva; ComponentLink6URL: https://datasheet.octopart.com:443/LQW15AN3N9B00D-Murata-datasheet-138757784.pdf?src-supplier=Ciiva; ComponentLink6Description: https://datasheet.octopart.com:443/LQW15AN3N9B00D-Murata-datasheet-138757784.pdf?src-supplier=Ciiva; ComponentLink7URL: https://datasheet.octopart.com:443/LQW15AN3N9B00D-Murata-datasheet-145451981.pdf?src-supplier=Geoflip; ComponentLink7Description: https://datasheet.octopart.com:443/LQW15AN3N9B00D-Murata-datasheet-145451981.pdf?src-supplier=Geoflip; ComponentLink8URL: https://datasheet.octopart.com:443/LQW15AN3N9B00D-Murata-datasheet-158451640.pdf?src-supplier=TME; ComponentLink8Description: https://datasheet.octopart.com:443/LQW15AN3N9B00D-Murata-datasheet-158451640.pdf?src-supplier=TME; ComponentLink9URL: https://datasheet.octopart.com:443/LQW15AN3N9B00D-Murata-datasheet-142296074.pdf?src-supplier=Arrow.cn; ComponentLink9Description: https://datasheet.octopart.com:443/LQW15AN3N9B00D-Murata-datasheet-142296074.pdf?src-supplier=Arrow.cn; ComponentLink10URL: https://datasheet.octopart.com:443/LQW15AN3N9B00D-Murata-datasheet-14066655.pdf?src-supplier=iiiC; ComponentLink10Description: https://datasheet.octopart.com:443/LQW15AN3N9B00D-Murata-datasheet-14066655.pdf?src-supplier=iiiC; ComponentLink11URL: https://datasheet.octopart.com/LQW15AN3N9B00D-Murata-datasheet-14392169.pdf; ComponentLink11Description: https://datasheet.octopart.com/LQW15AN3N9B00D-Murata-datasheet-14392169.pdf; ComponentLink12URL: https://datasheet.octopart.com:443/LQW15AN3N9B00D-Murata-datasheet-44661133.pdf?src-supplier=Future+Electronics; ComponentLink12Description: https://datasheet.octopart.com:443/LQW15AN3N9B00D-Murata-datasheet-44661133.pdf?src-supplier=Future+Electronics; ComponentLink13URL: http://sigma.octopart.com:80/reach_statement/Murata-company-16.pdf?src-supplier=Compliance+Statements; ComponentLink13Description: http://sigma.octopart.com:80/reach_statement/Murata-company-16.pdf?src-supplier=Compliance+Statements
R1-R3 = RES: Res Thick Film 0402 10K Ohm 1% 0.063W(1/16W) ±100ppm/C Pad SMD T/R; Manufacturer: Yageo; Manufacturer Part Number: RC0402FR-0710KL; Tolerance: +-1%; Power Dissipation: 62.5mW; Value: 10kΩ; Temperature Coefficient: 100ppm/°C; Voltage Rating: 50V; Power Rating: 1/16 W; Package Size: 0402; Supplier: DigiKey; Supplier Part Number: 311-10.0KLRCT-ND; RoHS: Compliant; Category: Chip SMD Resistors; Stock: 8092505; Pricing: 1=0.1, 10=0.007, 25=0.0056, 50=0.004, 100=0.0033, 10000=0.00127 (USD); Case/Package: 0402; Case Code (Imperial): 0402; Case Code (Metric): 0402; China RoHS: Non-Compliant; Composition: Thick Film; Country of Origin: Mainland China, Taiwan; Depth: 500µm; Export Control Classification Number (ECCN) Code: EAR99; Height: 350µm; Harmonized Tariff Schedule (HTS) Code: 8533.21.00.30; Introduction Date: 2004-10-04; Lead Free: Lead Free; Lead Pitch: 200µm; Length: 1mm; Lifecycle Status: Production; Max Operating Temperature: 155°C; Military Standard: Not; Min Operating Temperature: -55°C; Mounting Technology: Surface Mount; Pins: 2; Number of Terminals: 2; Number of Terminations: 2; Packaging: Tape & Reel; REACH SVHC: Yes; Schedule B: 8533210045, 8533210045|8533210045|8533210045|8533210045|8533210045|8533210045|8533210045|8533210045|8533210045|8533210045|8533210045|8533210045|8533210045|8533210045, 8533210045|8533210045|8533210045|8533210045|8533210045|8533210045|8533210045|8533210045|8533210045|8533210045|8533210045|8533210045|8533210045|8533210045|8533210045, 8533210045|8533210045|8533210045|8533210045|8533210045|8533210045|8533210045|8533210045|8533210045|8533210045|8533210045|8533210045|8533210045|8533210045|8533210045|8533210045; Termination: SMD/SMT; Voltage Rating (DC): 50V; Width: 500µm; Working Voltage: 50V; ComponentLink1URL: https://datasheet.octopart.com:443/RC0402FR-0710KL-Yageo-datasheet-175887523.pdf?src-supplier=Newark; ComponentLink1Description: https://datasheet.octopart.com:443/RC0402FR-0710KL-Yageo-datasheet-175887523.pdf?src-supplier=Newark; ComponentLink2URL: https://datasheet.octopart.com:443/RC0402FR-0710KL-Yageo-datasheet-12531192.pdf?src-supplier=Newark; ComponentLink2Description: https://datasheet.octopart.com:443/RC0402FR-0710KL-Yageo-datasheet-12531192.pdf?src-supplier=Newark; ComponentLink3URL: https://datasheet.octopart.com:443/RC0402FR-0710KL-Yageo-datasheet-8324527.pdf?src-supplier=Newark; ComponentLink3Description: https://datasheet.octopart.com:443/RC0402FR-0710KL-Yageo-datasheet-8324527.pdf?src-supplier=Newark; ComponentLink4URL: https://datasheet.octopart.com:443/RC0402FR-0710KL-Yageo-datasheet-10408619.pdf?src-supplier=element14+APAC; ComponentLink4Description: https://datasheet.octopart.com:443/RC0402FR-0710KL-Yageo-datasheet-10408619.pdf?src-supplier=element14+APAC; ComponentLink5URL: https://datasheet.octopart.com:443/RC0402FR-0710KL-Yageo-datasheet-62067350.pdf?src-supplier=element14+APAC; ComponentLink5Description: https://datasheet.octopart.com:443/RC0402FR-0710KL-Yageo-datasheet-62067350.pdf?src-supplier=element14+APAC; ComponentLink6URL: https://datasheet.octopart.com:443/RC0402FR-0710KL-Yageo-datasheet-21426659.pdf?src-supplier=element14+APAC; ComponentLink6Description: https://datasheet.octopart.com:443/RC0402FR-0710KL-Yageo-datasheet-21426659.pdf?src-supplier=element14+APAC; ComponentLink7URL: https://datasheet.octopart.com:443/RC0402FR-0710KL-Yageo-datasheet-164759695.pdf?src-supplier=Upverter; ComponentLink7Description: https://datasheet.octopart.com:443/RC0402FR-0710KL-Yageo-datasheet-164759695.pdf?src-supplier=Upverter; ComponentLink8URL: https://datasheet.octopart.com:443/RC0402FR-0710KL-Yageo-datasheet-103092701.pdf?src-supplier=Upverter; ComponentLink8Description: https://datasheet.octopart.com:443/RC0402FR-0710KL-Yageo-datasheet-103092701.pdf?src-supplier=Upverter; ComponentLink9URL: https://sigma.octopart.com:443/138820526/technical_drawing/Yageo-RC0402FR-0710KL.pdf?src-supplier=Upverter; ComponentLink9Description: https://sigma.octopart.com:443/138820526/technical_drawing/Yageo-RC0402FR-0710KL.pdf?src-supplier=Upverter; ComponentLink10URL: https://datasheet.octopart.com:443/RC0402FR-0710KL-Yageo-datasheet-98239111.pdf?src-supplier=Upverter; ComponentLink10Description: https://datasheet.octopart.com:443/RC0402FR-0710KL-Yageo-datasheet-98239111.pdf?src-supplier=Upverter; ComponentLink11URL: https://datasheet.octopart.com:443/RC0402FR-0710KL-Yageo-datasheet-68298067.pdf?src-supplier=Upverter; ComponentLink11Description: https://datasheet.octopart.com:443/RC0402FR-0710KL-Yageo-datasheet-68298067.pdf?src-supplier=Upverter; ComponentLink12URL: https://datasheet.octopart.com:443/RC0402FR-0710KL-Yageo-datasheet-68297981.pdf?src-supplier=Upverter; ComponentLink12Description: https://datasheet.octopart.com:443/RC0402FR-0710KL-Yageo-datasheet-68297981.pdf?src-supplier=Upverter; ComponentLink13URL: https://datasheet.octopart.com:443/RC0402FR-0710KL-Yageo-datasheet-141435361.pdf?src-supplier=Upverter; ComponentLink13Description: https://datasheet.octopart.com:443/RC0402FR-0710KL-Yageo-datasheet-141435361.pdf?src-supplier=Upverter; ComponentLink14URL: https://datasheet.octopart.com:443/RC0402FR-0710KL-Yageo-datasheet-12509768.pdf?src-supplier=Upverter; ComponentLink14Description: https://datasheet.octopart.com:443/RC0402FR-0710KL-Yageo-datasheet-12509768.pdf?src-supplier=Upverter; ComponentLink15URL: https://datasheet.octopart.com:443/RC0402FR-0710KL-Yageo-Group-datasheet-190305687.pdf?src-supplier=Future+Electronics; ComponentLink15Description: https://datasheet.octopart.com:443/RC0402FR-0710KL-Yageo-Group-datasheet-190305687.pdf?src-supplier=Future+Electronics; ComponentLink16URL: https://datasheet.octopart.com:443/RC0402FR-0710KL-Yageo-datasheet-137700087.pdf?src-supplier=Future+Electronics; ComponentLink16Description: https://datasheet.octopart.com:443/RC0402FR-0710KL-Yageo-datasheet-137700087.pdf?src-supplier=Future+Electronics; ComponentLink17URL: https://datasheet.octopart.com:443/RC0402FR-0710KL-Yageo-datasheet-8324255.pdf?src-supplier=Future+Electronics; ComponentLink17Description: https://datasheet.octopart.com:443/RC0402FR-0710KL-Yageo-datasheet-8324255.pdf?src-supplier=Future+Electronics; ComponentLink18URL: https://datasheet.octopart.com:443/RC0402FR-0710KL-Yageo-datasheet-8329306.pdf?src-supplier=element14; ComponentLink18Description: https://datasheet.octopart.com:443/RC0402FR-0710KL-Yageo-datasheet-8329306.pdf?src-supplier=element14; ComponentLink19URL: https://datasheet.octopart.com:443/RC0402FR-0710KL-Yageo-datasheet-505231.pdf?src-supplier=element14; ComponentLink19Description: https://datasheet.octopart.com:443/RC0402FR-0710KL-Yageo-datasheet-505231.pdf?src-supplier=element14; ComponentLink20URL: https://datasheet.octopart.com:443/RC0402FR-0710KL-Yageo-datasheet-175423674.pdf?src-supplier=SOS+electronic; ComponentLink20Description: https://datasheet.octopart.com:443/RC0402FR-0710KL-Yageo-datasheet-175423674.pdf?src-supplier=SOS+electronic; ComponentLink21URL: https://datasheet.octopart.com:443/RC0402FR-0710KL-Yageo-datasheet-79472498.pdf?src-supplier=Megastar; ComponentLink21Description: https://datasheet.octopart.com:443/RC0402FR-0710KL-Yageo-datasheet-79472498.pdf?src-supplier=Megastar; ComponentLink22URL: https://datasheet.octopart.com/RC0402FR-0710KL-Yageo-datasheet-73766026.pdf; ComponentLink22Description: https://datasheet.octopart.com/RC0402FR-0710KL-Yageo-datasheet-73766026.pdf; ComponentLink23URL: http://sigma.octopart.com:80/conflict_mineral_statement/Yageo-company-3.pdf?src-supplier=Compliance+Statements; ComponentLink23Description: http://sigma.octopart.com:80/conflict_mineral_statement/Yageo-company-3.pdf?src-supplier=Compliance+Statements; ComponentLink24URL: http://sigma.octopart.com:80/rohs_statement/Yageo-company-2.pdf?src-supplier=Compliance+Statements; ComponentLink24Description: http://sigma.octopart.com:80/rohs_statement/Yageo-company-2.pdf?src-supplier=Compliance+Statements